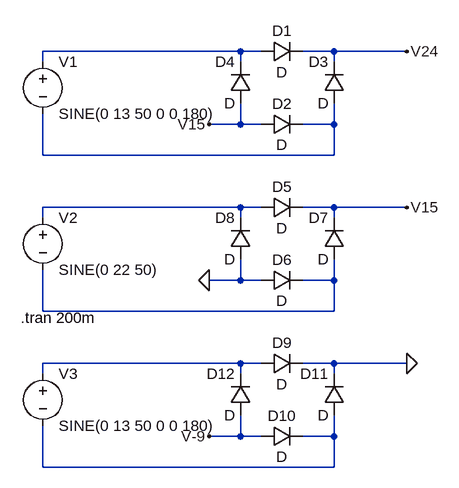
[diagram p0: schematic 3_transformers.asc]
3_transformers.asc, the LTspice schematic file:
Version 4
SHEET 1 880 716
WIRE 320 64 16 64
WIRE 352 64 320 64
WIRE 464 64 416 64
WIRE 576 64 464 64
WIRE 16 80 16 64
WIRE 320 80 320 64
WIRE 464 80 464 64
WIRE 320 176 320 144
WIRE 320 176 272 176
WIRE 352 176 320 176
WIRE 464 176 464 144
WIRE 464 176 416 176
WIRE 16 224 16 160
WIRE 464 224 464 176
WIRE 464 224 16 224
WIRE 320 304 16 304
WIRE 352 304 320 304
WIRE 464 304 416 304
WIRE 576 304 464 304
WIRE 16 320 16 304
WIRE 320 320 320 304
WIRE 464 320 464 304
WIRE 320 416 320 384
WIRE 320 416 272 416
WIRE 352 416 320 416
WIRE 464 416 464 384
WIRE 464 416 416 416
WIRE 16 464 16 400
WIRE 464 464 464 416
WIRE 464 464 16 464
WIRE 320 544 16 544
WIRE 352 544 320 544
WIRE 464 544 416 544
WIRE 576 544 464 544
WIRE 16 560 16 544
WIRE 320 560 320 544
WIRE 464 560 464 544
WIRE 320 656 320 624
WIRE 320 656 272 656
WIRE 352 656 320 656
WIRE 464 656 464 624
WIRE 464 656 416 656
WIRE 16 704 16 640
WIRE 464 704 464 656
WIRE 464 704 16 704
FLAG 272 416 0
FLAG 576 64 V24
FLAG 576 304 V15
FLAG 272 176 V15
FLAG 272 656 V-9
FLAG 576 544 0
SYMBOL voltage 16 64 R0
WINDOW 123 0 0 Left 2
WINDOW 39 0 0 Left 2
SYMATTR InstName V1
SYMATTR Value SINE(0 13 50 0 0 180)
SYMBOL voltage 16 304 R0
WINDOW 123 0 0 Left 2
WINDOW 39 0 0 Left 2
SYMATTR InstName V2
SYMATTR Value SINE(0 22 50)
SYMBOL diode 352 80 R270
WINDOW 0 32 32 VTop 2
WINDOW 3 0 32 VBottom 2
SYMATTR InstName D1
SYMBOL diode 352 192 R270
WINDOW 0 32 32 VTop 2
WINDOW 3 0 32 VBottom 2
SYMATTR InstName D2
SYMBOL diode 480 144 R180
WINDOW 0 24 64 Left 2
WINDOW 3 24 0 Left 2
SYMATTR InstName D3
SYMBOL diode 336 144 R180
WINDOW 0 24 64 Left 2
WINDOW 3 24 0 Left 2
SYMATTR InstName D4
SYMBOL diode 352 320 R270
WINDOW 0 32 32 VTop 2
WINDOW 3 0 32 VBottom 2
SYMATTR InstName D5
SYMBOL diode 352 432 R270
WINDOW 0 32 32 VTop 2
WINDOW 3 0 32 VBottom 2
SYMATTR InstName D6
SYMBOL diode 480 384 R180
WINDOW 0 24 64 Left 2
WINDOW 3 24 0 Left 2
SYMATTR InstName D7
SYMBOL diode 336 384 R180
WINDOW 0 24 64 Left 2
WINDOW 3 24 0 Left 2
SYMATTR InstName D8
SYMBOL voltage 16 544 R0
WINDOW 123 0 0 Left 2
WINDOW 39 0 0 Left 2
SYMATTR InstName V3
SYMATTR Value SINE(0 13 50 0 0 180)
SYMBOL diode 352 560 R270
WINDOW 0 32 32 VTop 2
WINDOW 3 0 32 VBottom 2
SYMATTR InstName D9
SYMBOL diode 352 672 R270
WINDOW 0 32 32 VTop 2
WINDOW 3 0 32 VBottom 2
SYMATTR InstName D10
SYMBOL diode 480 624 R180
WINDOW 0 24 64 Left 2
WINDOW 3 24 0 Left 2
SYMATTR InstName D11
SYMBOL diode 336 624 R180
WINDOW 0 24 64 Left 2
WINDOW 3 24 0 Left 2
SYMATTR InstName D12
TEXT -18 474 Left 2 !.tran 200m

The netlist it stands for:
* 3_transformers.asc
V1 N001 N002 SINE(0 13 50 0 0 180)
V2 N003 N004 SINE(0 22 50)
D1 N001 V24 D
D2 V15 N002 D
D3 N002 V24 D
D4 V15 N001 D
D5 N003 V15 D
D6 0 N004 D
D7 N004 V15 D
D8 0 N003 D
V3 N005 N006 SINE(0 13 50 0 0 180)
D9 N005 0 D
D10 V-9 N006 D
D11 N006 0 D
D12 V-9 N005 D
.model D D
.lib standard.dio
.tran 200m
.backanno
.end